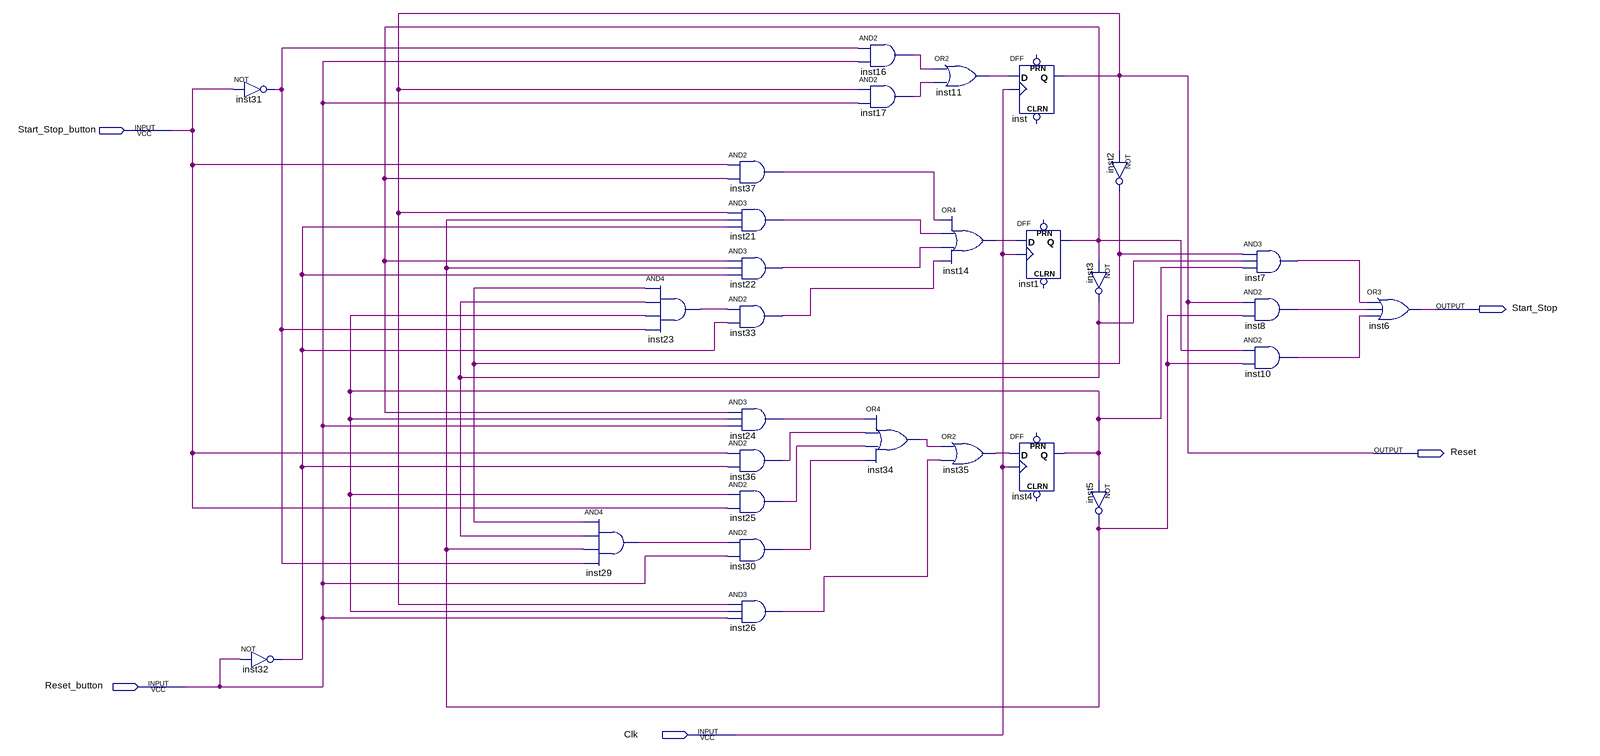
[diagram p0: schematic sheet]
// Quartus schematic cronometer_control.bdf as structural Verilog: 29 symbols, 5 pins
module cronometer_control (
  input  Start_Stop_button,
  input  Reset_button,
  input  Clk,
  output Start_Stop,
  output Reset
);

  wire inst1_q, inst2_out, inst3_out, inst4_q, inst5_out, inst7_out, inst8_out, inst10_out, inst11_out,
       inst14_out, inst16_out, inst17_out, inst21_out, inst22_out, inst23_out, inst24_out, inst25_out,
       inst26_out, inst29_out, inst30_out, inst31_out, inst32_out, inst33_out, inst34_out, inst35_out,
       inst36_out, inst37_out;

  not inst31 (inst31_out, Start_Stop_button);
  not inst32 (inst32_out, Reset_button);
  and inst29 (inst29_out, inst2_out, inst3_out, inst5_out, inst31_out);
  and inst23 (inst23_out, inst2_out, inst3_out, inst4_q, inst31_out);
  and inst37 (inst37_out, Start_Stop_button, inst1_q);
  and inst21 (inst21_out, Reset, inst5_out, inst32_out);
  and inst22 (inst22_out, inst1_q, inst5_out, inst32_out);
  and inst33 (inst33_out, inst23_out, inst32_out);
  and inst24 (inst24_out, inst1_q, inst4_q, Reset_button);
  and inst36 (inst36_out, Start_Stop_button, inst32_out);
  and inst25 (inst25_out, inst4_q, Start_Stop_button);
  and inst30 (inst30_out, inst29_out, Reset_button);
  and inst26 (inst26_out, Reset, inst4_q, Reset_button);
  and inst16 (inst16_out, inst31_out, Reset_button);
  and inst17 (inst17_out, Reset, Reset_button);
  or inst34 (inst34_out, inst24_out, inst36_out, inst25_out, inst30_out);
  or inst11 (inst11_out, inst16_out, inst17_out);
  or inst14 (inst14_out, inst37_out, inst21_out, inst22_out, inst33_out);
  or inst35 (inst35_out, inst34_out, inst26_out);
  DFF inst (.CLK(Clk), .D(inst11_out), .Q(Reset));  // open: CLRN, PRN
  DFF inst4 (.CLK(Clk), .D(inst35_out), .Q(inst4_q));  // open: CLRN, PRN
  DFF inst1 (.CLK(Clk), .D(inst14_out), .Q(inst1_q));  // open: CLRN, PRN
  not inst2 (inst2_out, Reset);
  not inst3 (inst3_out, inst1_q);
  not inst5 (inst5_out, inst4_q);
  and inst7 (inst7_out, inst2_out, inst3_out, inst4_q);
  and inst8 (inst8_out, Reset, inst5_out);
  and inst10 (inst10_out, inst1_q, inst5_out);
  or inst6 (Start_Stop, inst7_out, inst8_out, inst10_out);
endmodule
